# Altium schematic sheet MCU - STM32F410.SchDoc
size A4; SheetNumber: 4; SheetTotal: 5
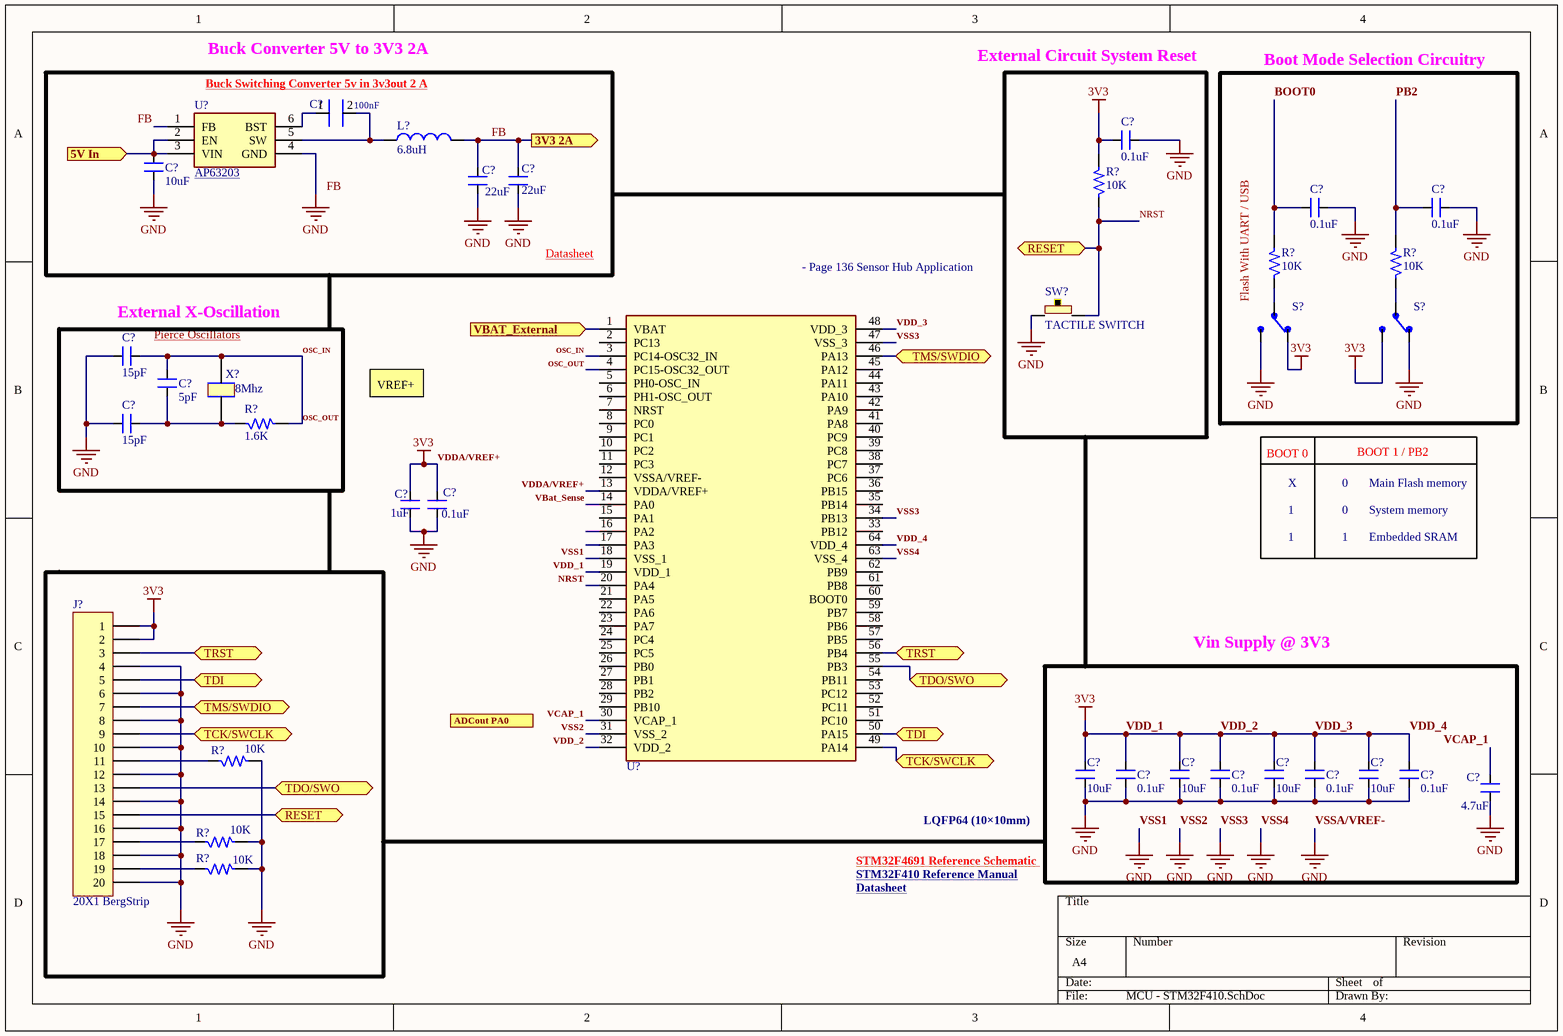
[diagram p0: MCU - STM32F410.SchDoc]

## Parts
(Parts that share a designator on the sheet are numbered #1, #2 ... from top to bottom, then left to right.)
C?#1  CC0402KPX7R7BB104  [Yageo_CC0402KPX]  (value not drawn)
C?#2  0.1uF  [CAP_0805]
C?#3  10uF  [CAP_0805]
C?#4  22uF  [CAP_0805]
C?#5  22uF  [CAP_0805]
C?#6  0.1uF  [CAP_0805]
C?#7  0.1uF  [CAP_0805]
C?#8  15pF  [CAP_0805]
C?#9  5pF  [RES_0603]
C?#10  15pF  [CAP_0805]
C?#11  1uF  [RES_0603]
C?#12  0.1uF  [CAP_0805]
C?#13  10uF  [RES_0603]
C?#14  0.1uF  [CAP_0805]
C?#15  10uF  [RES_0603]
C?#16  0.1uF  [CAP_0805]
C?#17  10uF  [RES_0603]
C?#18  0.1uF  [CAP_0805]
C?#19  10uF  [RES_0603]
C?#20  0.1uF  [CAP_0805]
C?#21  4.7uF  [CAP_0805]
J?  20X1 BergStrip  [CON20_100_40D72_TH_ST]
L?  6.8uH  [RES_0805]
R?#1  10K  [RES_0603]
R?#2  10K  [RES_0603]
R?#3  10K  [RES_0603]
R?#4  1.6K  [RES_0603]
R?#5  10K  [RES_0603]
R?#6  10K  [RES_0603]
R?#7  10K  [RES_0603]
S?#1  JS102011JCQN  (value not drawn)
S?#2  JS102011JCQN  (value not drawn)
SW?  TACTILE SWITCH  [SW_342_SMD]
U?#1  AP63203  [AP63203WU7]
U?#2  https://www.st.com/resource/en/datasheet/stm32f410cb.pdf  [QFP50P1200X1200X160-64N]  (value not drawn)
X?  8Mhz  [XTAL_314_240X47_SMD]

## Blocks framed on the sheet
Buck Converter 5V to 3V3 2A: C?#1 C?#3-C?#5 L? U?#1
Boot Mode Selection Circuitry: C?#6 C?#7 R?#2 R?#3 S?#1 S?#2
External X-Oscillation: C?#8-C?#10 R?#4 X?
Vin Supply @ 3V3: C?#13-C?#21

## Ports
3V3 2A (out), 5V In (in), ADCout PA0 (in), RESET (bidir), TCK/SWCLK (bidir), TDI (bidir), TDO/SWO (bidir), TMS/SWDIO (bidir), TRST (bidir), VBAT_External  (in)

## Nets
VDD_1: C?#2.2 C?#11.2 C?#12.1 C?#13.2 C?#14.1 C?#15.2 C?#16.1 C?#17.2 C?#18.1 C?#19.2 C?#20.1 J?.1 J?.2 R?#1.2 S?#1.1 S?#2.3 U?#2.13(VDDA/VREF+) U?#2.19(VDD_1) U?#2.32(VDD_2) U?#2.48(VDD_3) U?#2.64(VDD_4)  [also labelled 3V3, VDD_2, VDD_3, VDD_4, VDDA/VREF+]
VSS1: C?#2.1 C?#3.1 C?#4.1 C?#5.1 C?#6.1 C?#7.1 C?#8.2 C?#10.2 C?#11.1 C?#12.2 C?#13.1 C?#14.2 C?#15.1 C?#16.2 C?#17.1 C?#18.2 C?#19.1 C?#20.2 C?#21.1 J?.4 J?.6 J?.8 J?.10 J?.12 J?.14 J?.16 J?.18 J?.20 R?#5.2 R?#6.2 R?#7.2 S?#1.3 S?#2.1 SW?.1 U?#1.4(GND) U?#2.18(VSS_1) U?#2.31(VSS_2) U?#2.34(PB13) U?#2.47(VSS_3) U?#2.63(VSS_4)  [also labelled GND, VSS2, VSS3, VSS4, VSSA/VREF-]
5V In: C?#3.2 U?#1.2(EN) U?#1.3(VIN) ; port 5V In
BOOT0: C?#6.2 R?#2.2
FB: C?#4.2 C?#5.2 L?.2 U?#1.1(FB) ; port 3V3 2A
NRST: J?.15 R?#1.1 SW?.2 U?#2.20(PA4) ; port RESET
OSC_IN: C?#8.1 C?#9.2 R?#4.2 U?#2.3(PC14-OSC32_IN) U?#2.4(PC15-OSC32_OUT) X?.2  [also labelled OSC_OUT]
PB2: C?#7.2 R?#3.2
TCK/SWCLK: J?.9 U?#2.49(PA14) ; port TCK/SWCLK
TDI: J?.5 U?#2.50(PA15) ; port TDI
TDO/SWO: J?.13 U?#2.55(PB3) ; port TDO/SWO
TMS/SWDIO: J?.7 U?#2.46(PA13) ; port TMS/SWDIO
TRST: J?.3 U?#2.56(PB4) ; port TRST
VBAT_External : U?#2.1(VBAT) ; port VBAT_External 
VBat_Sense: U?#2.14(PA0)
VCAP_1: C?#21.2 U?#2.30(VCAP_1)
NetC?#1_1: C?#1.1 U?#1.6(BST)
NetC?#1_2: C?#1.2 L?.1 U?#1.5(SW)
NetC?#9_1: C?#9.1 C?#10.1 R?#4.1 X?.1
NetJ?_11: J?.11 R?#5.1
NetJ?_17: J?.17 R?#6.1
NetJ?_19: J?.19 R?#7.1
NetR?#2_1: R?#2.1 S?#1.2
NetR?#3_1: R?#3.1 S?#2.2

Not connected (* = marked no-connect by the designer): U?#2 2(PC13) 5(PH0-OSC_IN) 6(PH1-OSC_OUT) 7(NRST) 8(PC0) 9(PC1) 10(PC2) 11(PC3) 12(VSSA/VREF-) 15(PA1) 16(PA2) 17(PA3) 21(PA5) 22(PA6) 23(PA7) 24(PC4) 25(PC5) 26(PB0) 27(PB1) 28(PB2) 29(PB10) 33(PB12) 35(PB14) 36(PB15) 37(PC6) 38(PC7) 39(PC8) 40(PC9) 41(PA8) 42(PA9) 43(PA10) 44(PA11) 45(PA12) 51(PC10) 52(PC11) 53(PC12) 54(PB11) 57(PB5) 58(PB6) 59(PB7) 60(BOOT0) 61(PB8) 62(PB9)

## Notes on the sheet
- Buck Switching Converter 5v in 3v3out 2 A <https://4donline.ihs.com/images/VipMasterIC/IC/DIOD/DIOD-S-A0007089856/DIOD-S-A0007089856-1.pdf?hkey=CECEF36DEECDED6468708AAF2E19C0C6>
- (near C?#1) 100nF
- External Circuit System Reset
- Datasheet <https://4donline.ihs.com/images/VipMasterIC/IC/DIOD/DIOD-S-A0007089856/DIOD-S-A0007089856-1.pdf?hkey=CECEF36DEECDED6468708AAF2E19C0C6>
- - Page 136 Sensor Hub Application
- Flash With UART / USB
- (near C?#8) Pierce Oscillators <https://www.st.com/resource/en/application_note/an2867-guidelines-for-oscillator-design-on-stm8afals-and-stm32-mcusmpus-stmicroelectronics.pdf>
- VREF+ is internally connected to VDDA and VREF- is internally connected to VSSA.
- BOOT 0
- X
- 1
- 0
- BOOT 1 / PB2
- Main Flash memory
- System memory
- Embedded SRAM
- LQFP64 (10×10mm)
- STM32F4691 Reference Schematic <https://wiki-power.com/en/STM32F4%E7%A1%AC%E4%BB%B6%E5%BC%80%E5%8F%91/>
- Datasheet <https://www.st.com/resource/en/datasheet/stm32f410cb.pdf>
- STM32F410 Reference Manual <https://www.st.com/resource/en/schematic_pack/mb1136-default-c04_schematic.pdf>
- Labels drawn without touching a wire or pin: FB

## Library data of the parts
C?#1 = CAP_100nF_0.1uF_10V_0402: Multilayer Ceramic Capacitor, 0.1 uF, 10 V, ± 10%, X7R, 0402 [1005 Metric]
C?#2 C?#6 C?#7 C?#12 C?#14 C?#16 C?#18 C?#20 = CAP_0.1uF-50V-10%-0805: 0.1µF ±10% 50V Ceramic Capacitor X7R 0805 (2012 Metric); Manufacturer: Samsung; Manufacturer Part Number: CL21B104KBCNNNC; Alternate Part Number-1: NA; Case/Package: 0805; Supplier-1: SIRICOM; Supplier Part Number-1: 0805B104K500CT
C?#3 = CAP_10uF-50V-10%-0805_1: 10µF ±10% 50V Ceramic Capacitor X7R 0805 (2012 Metric); Manufacturer: Samsung; Manufacturer Part Number: CL21B104KBCNNNC; Alternate Part Number-1: NA; Case/Package: 0805; Supplier-1: SIRICOM; Supplier Part Number-1: 0805B104K500CT
C?#4 C?#5 = CAP_22uF-25V-20%-0805: 22µF ±20% 25V Ceramic Capacitor X5R 0805 (2012 Metric); Manufacturer: Murata; Manufacturer Part Number: GRM21BR61E226ME44L; Alternate Part Number-1: NA; Case/Package: 0805; Supplier-1: LCSC; Supplier Part Number-1: C86816
C?#8 C?#10 = CAP_15pF-50V-10%-0805: 15pF ±5% 50V Ceramic Capacitor C0G, NP0 0805 (2012 Metric); Manufacturer: Kyocera AVX; Manufacturer Part Number: CC0805JRNPO9BN150; Alternate Part Number-1: NA; Case/Package: 0805; Supplier-1: SIRICOM; Supplier Part Number-1: 0805N150J500CT
C?#9 = CAP_GENERIC-0402: Generic capacitor Symbol; Manufacturer: NA; Manufacturer Part Number: NA; Case/Package: 0603; Supplier-1: NA; Supplier Part Number-1: NA; Alternate Part Number-1: NA
C?#11 C?#13 C?#15 C?#17 C?#19 = CAP_GENERIC_0603_1: Ceramic Capacitor C0G, NP0 0603 (2012 Metric); Manufacturer: Yageo; Manufacturer Part Number: 600F1R0BT250XT; Alternate Part Number-1: NA; Case/Package: 0805; Supplier-1: Mouser; Supplier Part Number-1: 581-600F1R0BT
C?#21 = CAP_4.7uF-50V-10%-0805: 4.7µF ±10% 50V Ceramic Capacitor X5R 0805 (2012 Metric); Manufacturer: Yageo; Manufacturer Part Number: GRM21BR61H475KE51L; Alternate Part Number-1: NA; Case/Package: 0805; Supplier-1: SIRICOM; Supplier Part Number-1: CL21A475KBQNNNE
J? = CON-BS-PLG_20X1-100-ST-TH: 20 Pins, 1 Row 2.54mm Pitch, Straight bergstrip, Female; Manufacturer Part Number: NA; Case/Package: TH; Manufacturer: NA; Supplier-1: SP ROAD; Supplier Part Number-1: NA; Alternate Part Number-1: NA
L? = IND_0805_Generic: Manufacturer: Walsin; Manufacturer Part Number: WR08X1001FTL; Case/Package: 0805; Supplier-1: SP ROAD; Supplier Part Number-1: RC0805JR-071KL; Alternate Part Number-1: WR08X1001FTL
R?#1-R?#3 R?#5-R?#7 = RES_10K-0.1W-1%-0603: 10 kOhms ±1% 0.1W, 1/10W Chip Resistor 0603 (1608 Metric) Automotive AEC-Q200 Thick Film; Manufacturer: Walsin; Manufacturer Part Number: WR06X1002FTL; Alternate Part Number-1: 0603WAJ0103T5E; Case/Package: 0603; Supplier-1: SIRICOM; Supplier Part Number-1: WR06X1002FTL
R?#4 = RES_1.6K-0.1W-1%-0603: 1.6 kOhms ±1% 0.1W, 1/10W Chip Resistor 0603 (1608 Metric) Thin Film; Manufacturer: NA; Manufacturer Part Number: NA; Case/Package: 0603; Supplier-1: SIRICOM; Supplier Part Number-1: NA; Alternate Part Number-1: NA
S?#1 S?#2 = Switch Slide Spdt 300ma 6v: SPDT SMD
SW? = SW1_RS-282G05A3-SMRT-SMD: Tactile Switch SPST-NO Top Actuated Surface Mount; Manufacturer: ITT C&K; Alternate Part Number-1: NA; Manufacturer Part Number: RS-282G05A3-SMRT; Case/Package: SMD; Supplier-1: SP ROAD; Supplier Part Number-1: RS-282G05A3-SMRT
U?#1 = IC_AP63203WU-7 Buck Converter 3V3 Out 2A: Switching Voltage Regulators DCDC Conv HV Buck TSOT26 T&R 3K
U?#2 = IC_STM32F410R8T6: STMICROELECTRONICS - STM32F410R8T6 - ARM MCU, STM32 Family STM32F4 Series Microcontrollers, ARM Cortex-M4F, 32bit, 100 MHz, 64 KB, 32 KB
X? = XTAL_8MHZ-ECS-80-32-5PX-SMD: 8MHz ±30ppm Crystal 32pF 60 Ohms HC-49/US; Manufacturer: Fox Electronics; Manufacturer Part Number: ECS-80-32-5PX-TR; Alternate Part Number-1: NA; Case/Package: SMD/SMT; Supplier-1: SP ROAD; Supplier Part Number-1: ECS-80-32-5PX-TR